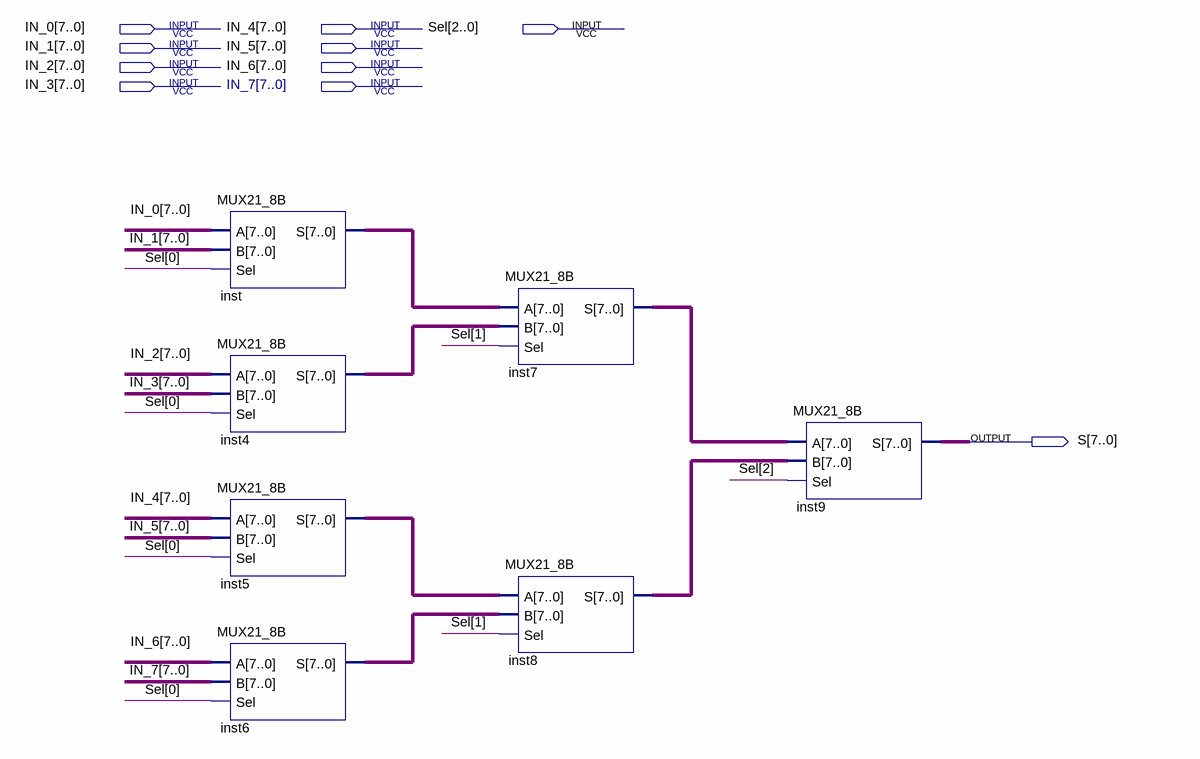
[diagram p0: schematic sheet]
// Quartus schematic MUX81_8B.bdf as structural Verilog: 7 symbols, 10 pins
module MUX81_8B (
  input  [7:0] IN_0,
  input  [7:0] IN_4,
  input  [2:0] Sel,
  input  [7:0] IN_1,
  input  [7:0] IN_5,
  input  [7:0] IN_2,
  input  [7:0] IN_6,
  input  [7:0] IN_3,
  input  [7:0] IN_7,
  output [7:0] S
);

  wire [7:0] inst4_s, inst5_s, inst6_s, inst7_s, inst8_s, inst_s;

  MUX21_8B inst (.A(IN_0), .B(IN_1), .Sel(Sel[0]), .S(inst_s));
  MUX21_8B inst4 (.A(IN_2), .B(IN_3), .Sel(Sel[0]), .S(inst4_s));
  MUX21_8B inst5 (.A(IN_4), .B(IN_5), .Sel(Sel[0]), .S(inst5_s));
  MUX21_8B inst6 (.A(IN_6), .B(IN_7), .Sel(Sel[0]), .S(inst6_s));
  MUX21_8B inst7 (.A(inst_s), .B(inst4_s), .Sel(Sel[1]), .S(inst7_s));
  MUX21_8B inst8 (.A(inst5_s), .B(inst6_s), .Sel(Sel[1]), .S(inst8_s));
  MUX21_8B inst9 (.A(inst7_s), .B(inst8_s), .Sel(Sel[2]), .S(S));
endmodule
